# Altium schematic sheet elec_array.SchDoc
size 99 x 127 mm; SheetNumber: 1; SheetTotal: 1
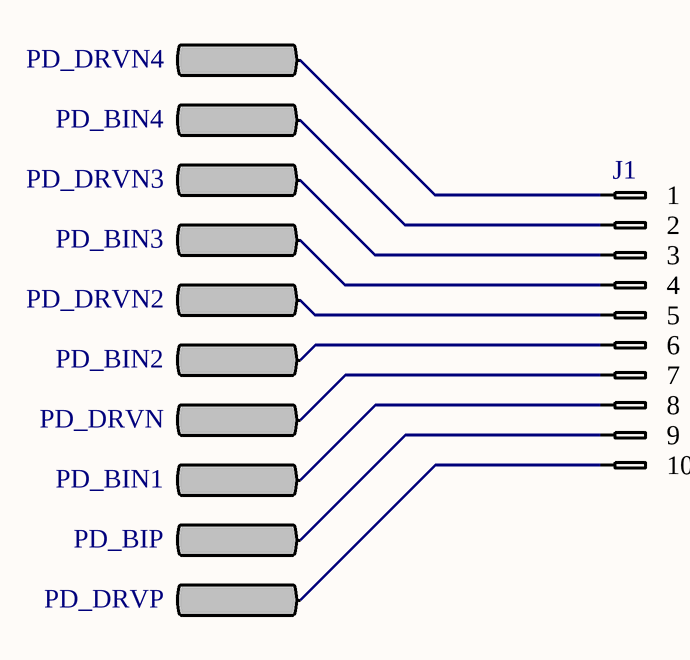
[diagram p0: elec_array.SchDoc]

## Parts
J1  Array_Conn_Mate_Pad  [ARRAY_CONN_MATE_PAD]  (value not drawn)
PD_BIN1  Skin_Interface_Pad  [Skin_Interface_Pad]  (value not drawn)
PD_BIN2  Skin_Interface_Pad  [Skin_Interface_Pad]  (value not drawn)
PD_BIN3  Skin_Interface_Pad  [Skin_Interface_Pad]  (value not drawn)
PD_BIN4  Skin_Interface_Pad  [Skin_Interface_Pad]  (value not drawn)
PD_BIP  Skin_Interface_Pad  [Skin_Interface_Pad]  (value not drawn)
PD_DRVN  Skin_Interface_Pad  [Skin_Interface_Pad]  (value not drawn)
PD_DRVN2  Skin_Interface_Pad  [Skin_Interface_Pad]  (value not drawn)
PD_DRVN3  Skin_Interface_Pad  [Skin_Interface_Pad]  (value not drawn)
PD_DRVN4  Skin_Interface_Pad  [Skin_Interface_Pad]  (value not drawn)
PD_DRVP  Skin_Interface_Pad  [Skin_Interface_Pad]  (value not drawn)

## Nets
NetJ1_1: J1.1 PD_DRVN4.1
NetJ1_2: J1.2 PD_BIN4.1
NetJ1_3: J1.3 PD_DRVN3.1
NetJ1_4: J1.4 PD_BIN3.1
NetJ1_5: J1.5 PD_DRVN2.1
NetJ1_6: J1.6 PD_BIN2.1
NetJ1_7: J1.7 PD_DRVN.1
NetJ1_8: J1.8 PD_BIN1.1
NetJ1_9: J1.9 PD_BIP.1
NetJ1_10: J1.10 PD_DRVP.1

## Library data of the parts
J1 = Array_Conn_Mate_Pad: System: Connector